# EAGLE schematic schema besturing rc auto (EAGLE 9.6.2)
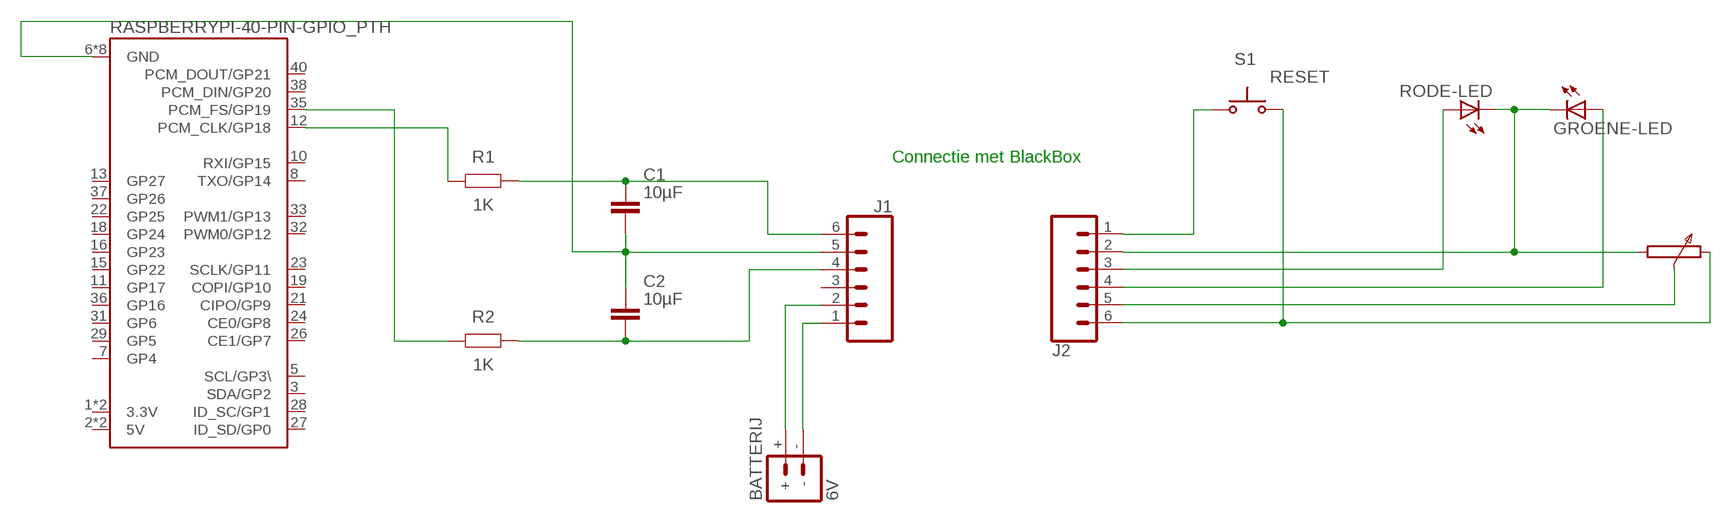
[diagram p0: schematic, sheet 1]

## Parts
BATTERIJ  6V  BATTERY_CONN_DEANS  [DEANS]
C1  10µF  C_CHIP-0402(1005-METRIC)  [CAPC1005X60]
C2  10µF  C_CHIP-0402(1005-METRIC)  [CAPC1005X60]
GROENE-LED  LED5MM  [LED5MM]
J1  CONN_06FEMALE_LOCK  [1X06_FEMALE_LOCK.010]
J2  CONN_06FEMALE_LOCK  [1X06_FEMALE_LOCK.010]
J3  RASPBERRYPI-40-PIN-GPIO_PTH  [2X20_SHROUDED]
R1  1K  R_AXIAL-7.2MM-PITCH  [RESAD724W46L381D178B]
R2  1K  R_AXIAL-7.2MM-PITCH  [RESAD724W46L381D178B]
RODE-LED  LED5MM  [LED5MM]
S1  RESET  SWITCH-OMRON_B3U-1000P  [SWITCH-OMRON_B3U-1000P]

## Nets
N$1: J3.12(PCM_CLK/GP18) R1.1
N$2: J3.35(PCM_FS/GP19) R2.1
N$3: J2.1 S1.1(P)
N$4: C1.1 J1.6 R1.2
N$5: C2.2 J1.4 R2.2
N$6: C1.2 C2.1 J1.5 J3.6(GND) J3.9(GND) J3.14(GND) J3.20(GND) J3.25(GND) J3.30(GND) J3.34(GND) J3.39(GND)
N$7: J2.6 S1.2(S)
N$10: J2.5
N$11: GROENE-LED.K(C) J2.2 RODE-LED.K(C)
N$12: J2.3 RODE-LED.A
N$13: GROENE-LED.A J2.4
N$14: BATTERIJ.+ J1.2
N$15: BATTERIJ.- J1.1
Unconnected: J1.3 J3.3(SDA/GP2) J3.5(SCL/GP3\) J3.7(GP4) J3.8(TXO/GP14) J3.10(RXI/GP15) J3.11(GP17) J3.13(GP27) J3.15(GP22) J3.16(GP23) J3.18(GP24) J3.19(COPI/GP10) J3.21(CIPO/GP9) J3.22(GP25) J3.23(SCLK/GP11) J3.24(CE0/GP8) J3.26(CE1/GP7) J3.27(ID_SD/GP0) J3.28(ID_SC/GP1) J3.29(GP5) J3.31(GP6) J3.32(PWM0/GP12) J3.33(PWM1/GP13) J3.36(GP16) J3.37(GP26) J3.38(PCM_DIN/GP20) J3.40(PCM_DOUT/GP21)

## Notes on the sheet
- Connectie met BlackBox

## Power pins joined to a net without a drawn wire
3.3V: J3.1(3.3V) J3.17(3.3V)
5V: J3.2(5V) J3.4(5V)

## Library data of the parts
BATTERIJ = SparkFun-Connectors:BATTERY_CONN: Battery Connectors Various footprints for battery connections SparkFun Products: Deans Connector -M/F Pair <https://www.sparkfun.com/products/11864>; SF_ID: PRT-11864
C1 C2 = Capacitor:C: Capacitor - Generic; CATEGORY: Capacitor; PACKAGE_SIZE: 0402; PACKAGE_TYPE: SMD; SUBCATEGORY: Ceramic Capacitors; TYPE: MLCC
GROENE-LED RODE-LED = adafruit:LED: LED OSRAM: - CHIPLED LG R971, LG N971, LY N971, LG Q971, LY Q971, LO R971, LY R971 LH N974, LH R974 LS Q976, LO Q976, LY Q976 LO Q996 - Hyper CHIPLED LW Q18S LB Q993, LB Q99A, LB R99A - SideLED LS A670, LO A670, LY A670, LG A670, LP A670 LB A673, LV A673, LT A673, LW A673 LH A674 LY A675 LS A676, LA A676, LO A676, LY A676, LW A676 LS A679, LY A679, LG A679 - Hyper Micro SIDELED® LS Y876, LA Y876, LO Y876, LY Y876 LT Y87S - SmartLED LW L88C, LW L88S LB L89C, LB L89S, LG L890 LS L89K, LO L89K, LY L89K LS L896, LA L896, LO L896, LY L896 - TOPLED LS T670, LO T670, LY T670, LG T670, LP T670 LSG T670, LSP T670, LSY T670, LOP T670, LYG T670 LG T671, LOG T671, LSG T671 LB T673, LV T673, LT T673, LW T673 LH T674 LS T676, LA T676, LO T676, LY T676, LB T676, LH T676, LSB T676, LW T676 LB T67C, LV T67C, LT T67C, LS T67K, LO T67K, LY T67K, LW E67C LS E67B, LA E67B, LO E67B, LY E67B, LB E67C, LV E67C, LT E67C LW T67C LS T679, LY T679, LG T679 LS T770, LO T770, LY T770, LG T770, LP T770 LB T773, LV T773, LT T773, LW T773 LH T774 LS E675, LA E675, LY E675, LS T675 LS T776, LA T776, LO T776, LY T776, LB T776 LHGB T686 LT T68C, LB T68C - Hyper Mini TOPLED® LB M676 - Mini TOPLED Santana® LG M470 LS M47K, LO M47K, LY M47K Source: http://www.osram.convergy.de/
J1 J2 = SparkFun-Connectors:CONN_06: Multi connection point. Often used as Generic Header-pin footprint for 0.1 inch spaced/style header connections On any of the 0.1 inch spaced packages, you can populate with these: Break Away Headers - Straight <https://www.sparkfun.com/products/116> (PRT-00116) Break Away Male Headers - Right Angle <https://www.sparkfun.com/products/553> (PRT-00553) Female Headers <https://www.sparkfun.com/products/115> (PRT-00115) Break Away Headers - Machine Pin <https://www.sparkfun.com/products/117> (PRT-00117) Break Away Female Headers - Swiss Machine Pin <https://www.sparkfun.com/products/743> (PRT-00743) Arduino Stackable Header - 6 Pin <https://www.sparkfun.com/products/9280> (PRT-09280) Screw Terminals 2.54mm Pitch (6-Pin) <https://www.sparkfun.com/products/16499> (PRT-16499) For SCREWTERMINALS and SPRING TERMINALS visit here: Screw Terimnals on SparkFun.com <https://www.sparkfun.com/search/results?term=Screw+Terminals> (5mm/3.5mm/2.54mm spacing) This device is also useful as a general connection point to wire up your design to another part of your project. Our various solder wires solder well into these plated through hole pads. Hook-Up Wire - Assortment (Stranded, 22 AWG) <https://www.sparkfun.com/products/11375> (PRT-11375) Hook-Up Wire - Assortment (Solid Core, 22 AWG) <https://www.sparkfun.com/products/11367> (PRT-11367) View the entire wire category on our website here <https://www.sparkfun.com/categories/141>
J3 = SparkFun-Connectors:RASPBERRYPI-40-PIN-GPIO: Raspberry Pi GPIO Header 2x20 pin connector, as found on B, B+, A+ models. Both shrouded PTH and SMT versions available. SparkFun Products: GPIO Shrouded Header <https://www.sparkfun.com/products/13054>- PTH SparkFun Pi Wedge (Preassembled) <https://www.sparkfun.com/products/13717>; PROD_ID: CONN-12263; SF_ID: PRT-13054
R1 R2 = Resistor:R: Resistor Fixed - Generic; CATEGORY: Resistors; DESCRIPTION: Axial Resistor 7.24 mm pitch 3.81 mm body length 1.78 mm body diameter; PACKAGE_SIZE: AXIAL; PACKAGE_TYPE: THT
S1 = 52101-101-REV-A_v16:SWITCH-OMRON_B3U-1000P: SMD Tactile Switch - Ultra Small